# EAGLE design AC_load (EAGLE 6.5.0)
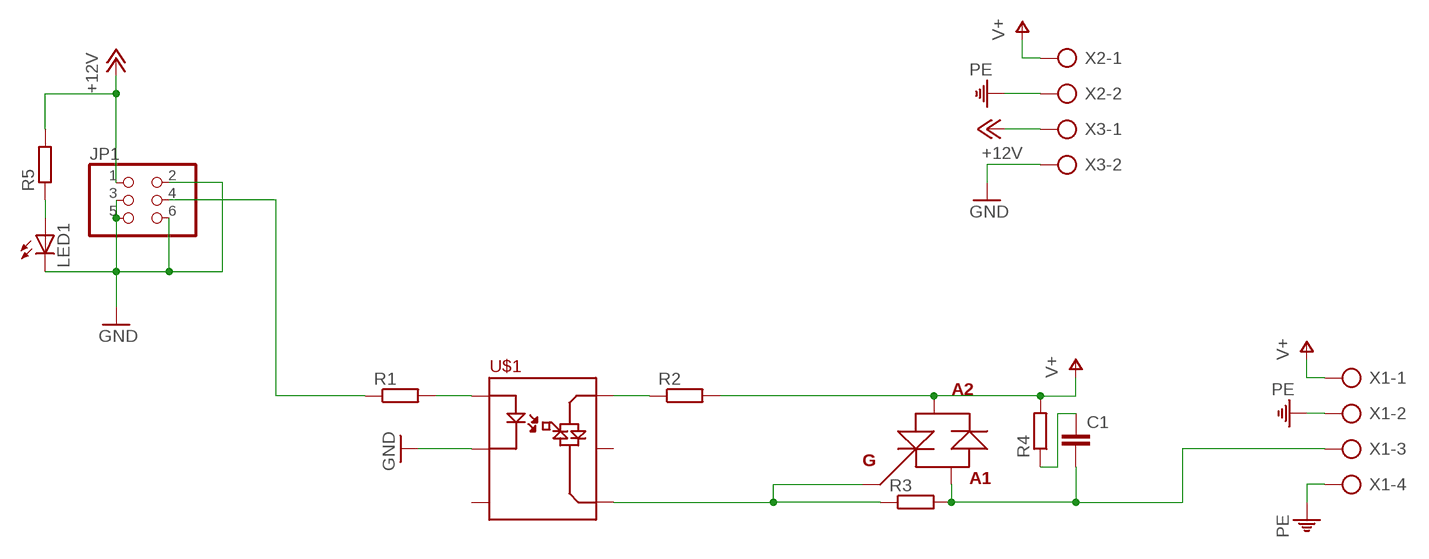
[diagram p0: schematic, sheet 1]

## Parts
C1  C-EU102-064X133  [C102-064X133]
JP1  PINHD-2X3  [2X03]
LED1  LEDSML1206  [SML1206]
R1  R-EU_M1206  [M1206]
R2  R-EU_M1206  [M1206]
R3  R-EU_M1206  [M1206]
R4  R-EU_M1206  [M1206]
R5  R-EU_M1206  [M1206]
U$1  MOC3043  [DIL06]
U$2  BTB16  [TO220NORM]
X1  AK500/4  [AK500/4]
X2  AK500/2  [AK500/2]
X3  AK500/2  [AK500/2]

## Nets
+12V: JP1.1 R5.2 X3.1
GND: JP1.2 JP1.3 JP1.5 JP1.6 LED1.C U$1.2(LED_OUT) X3.2
N$1: R1.2 U$1.1(LED_IN)
N$2: C1.2 R3.2 U$2.MT1(A1) X1.3
N$3: JP1.4 R1.1
N$4: R3.1 U$1.4(SIM2) U$2.GATE(G)
N$6: R2.1 U$1.6(SIM1)
N$7: C1.1 R4.1
N$14: LED1.A R5.1
PE: X1.2 X1.4 X2.2
V+: R2.2 R4.2 U$2.MT2(A2) X1.1 X2.1
Unconnected: U$1.3(N/C) U$1.5(N/C2)

## Library data of the parts
C1 = rcl:C-EU: CAPACITOR, European symbol
JP1 = pinhead:PINHD-2X3: PIN HEADER
LED1 = led:LED: LED OSRAM: - CHIPLED LG R971, LG N971, LY N971, LG Q971, LY Q971, LO R971, LY R971 LH N974, LH R974 LS Q976, LO Q976, LY Q976 LO Q996 - Hyper CHIPLED LW Q18S LB Q993, LB Q99A, LB R99A - SideLED LS A670, LO A670, LY A670, LG A670, LP A670 LB A673, LV A673, LT A673, LW A673 LH A674 LY A675 LS A676, LA A676, LO A676, LY A676, LW A676 LS A679, LY A679, LG A679 - Hyper Micro SIDELED® LS Y876, LA Y876, LO Y876, LY Y876 LT Y87S - SmartLED LW L88C, LW L88S LB L89C, LB L89S, LG L890 LS L89K, LO L89K, LY L89K LS L896, LA L896, LO L896, LY L896 - TOPLED LS T670, LO T670, LY T670, LG T670, LP T670 LSG T670, LSP T670, LSY T670, LOP T670, LYG T670 LG T671, LOG T671, LSG T671 LB T673, LV T673, LT T673, LW T673 LH T674 LS T676, LA T676, LO T676, LY T676, LB T676, LH T676, LSB T676, LW T676 LB T67C, LV T67C, LT T67C, LS T67K, LO T67K, LY T67K, LW E67C LS E67B, LA E67B, LO E67B, LY E67B, LB E67C, LV E67C, LT E67C LW T67C LS T679, LY T679, LG T679 LS T770, LO T770, LY T770, LG T770, LP T770 LB T773, LV T773, LT T773, LW T773 LH T774 LS E675, LA E675, LY E675, LS T675 LS T776, LA T776, LO T776, LY T776, LB T776 LHGB T686 LT T68C, LB T68C - Hyper Mini TOPLED® LB M676 - Mini TOPLED Santana® LG M470 LS M47K, LO M47K, LY M47K Source: http://www.osram.convergy.de LUXEON: - LUMILED® LXK2-PW12-R00, LXK2-PW12-S00, LXK2-PW14-U00, LXK2-PW14-V00 LXK2-PM12-R00, LXK2-PM12-S00, LXK2-PM14-U00 LXK2-PE12-Q00, LXK2-PE12-R00, LXK2-PE12-S00, LXK2-PE14-T00, LXK2-PE14-U00 LXK2-PB12-K00, LXK2-PB12-L00, LXK2-PB12-M00, LXK2-PB14-N00, LXK2-PB14-P00, LXK2-PB14-Q00 LXK2-PR12-L00, LXK2-PR12-M00, LXK2-PR14-Q00, LXK2-PR14-R00 LXK2-PD12-Q00, LXK2-PD12-R00, LXK2-PD12-S00 LXK2-PH12-R00, LXK2-PH12-S00 LXK2-PL12-P00, LXK2-PL12-Q00, LXK2-PL12-R00 Source: www.luxeon.com KINGBRIGHT: KA-3528ASYC Source: www.kingbright.com
R1-R5 = rcl:R-EU_: RESISTOR, European symbol
U$1 = OpticalSwitch:MOC3043
U$2 = Semistors:BTB16: Silicon Bidirectional Thyristors. Blocking Voltage to 800 V. On-State Current Rating of 16 A RMS at 25°C. http://www.onsemi.ru.com/pub_link/Collateral/BTB16-600CW3-D.PDF
X1 = con-ptr500:AK500/4: CONNECTOR; OC_FARNELL: unknown; OC_NEWARK: unknown
X2 X3 = con-ptr500:AK500/2: CONNECTOR; OC_FARNELL: unknown; OC_NEWARK: unknown

## Board
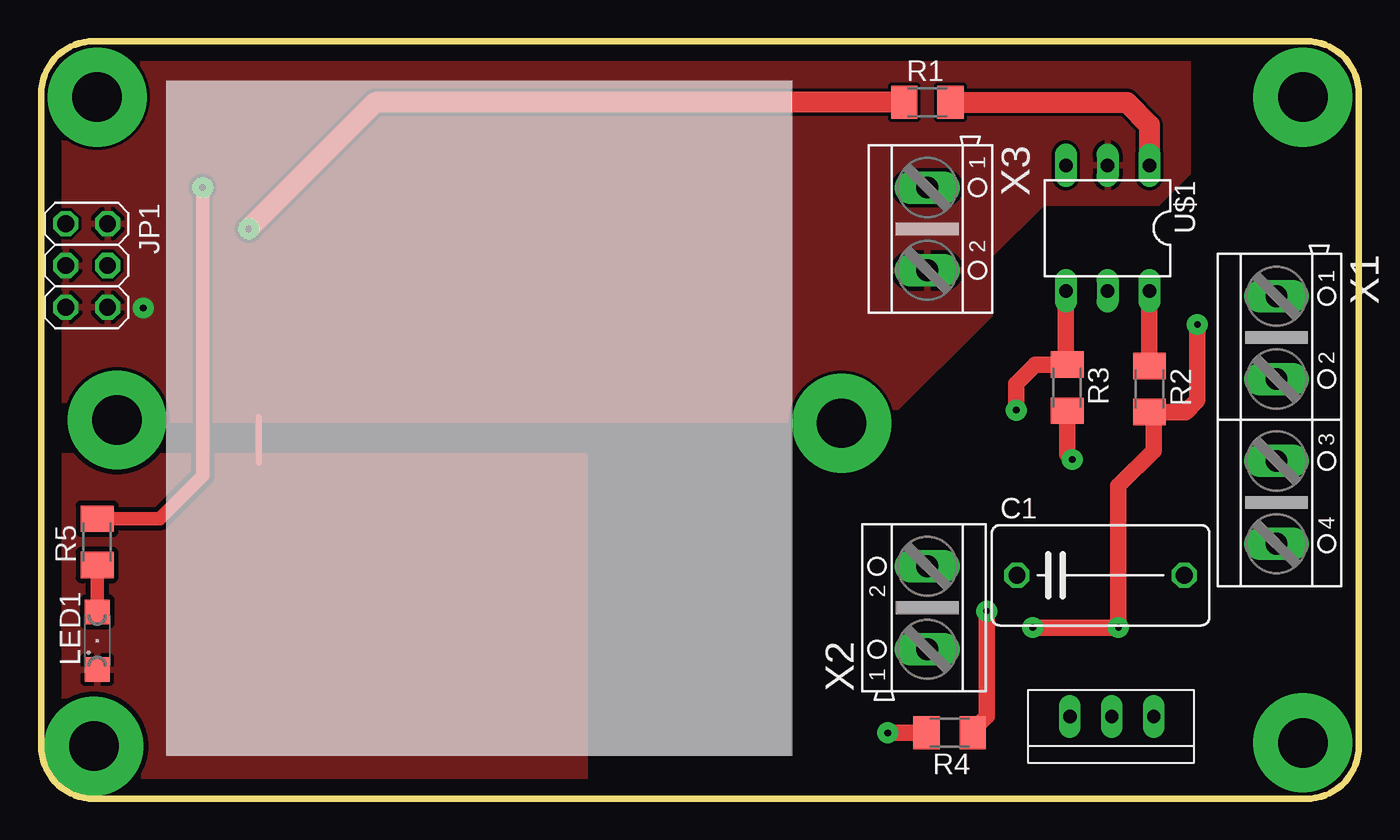
[diagram p1: board, top side]
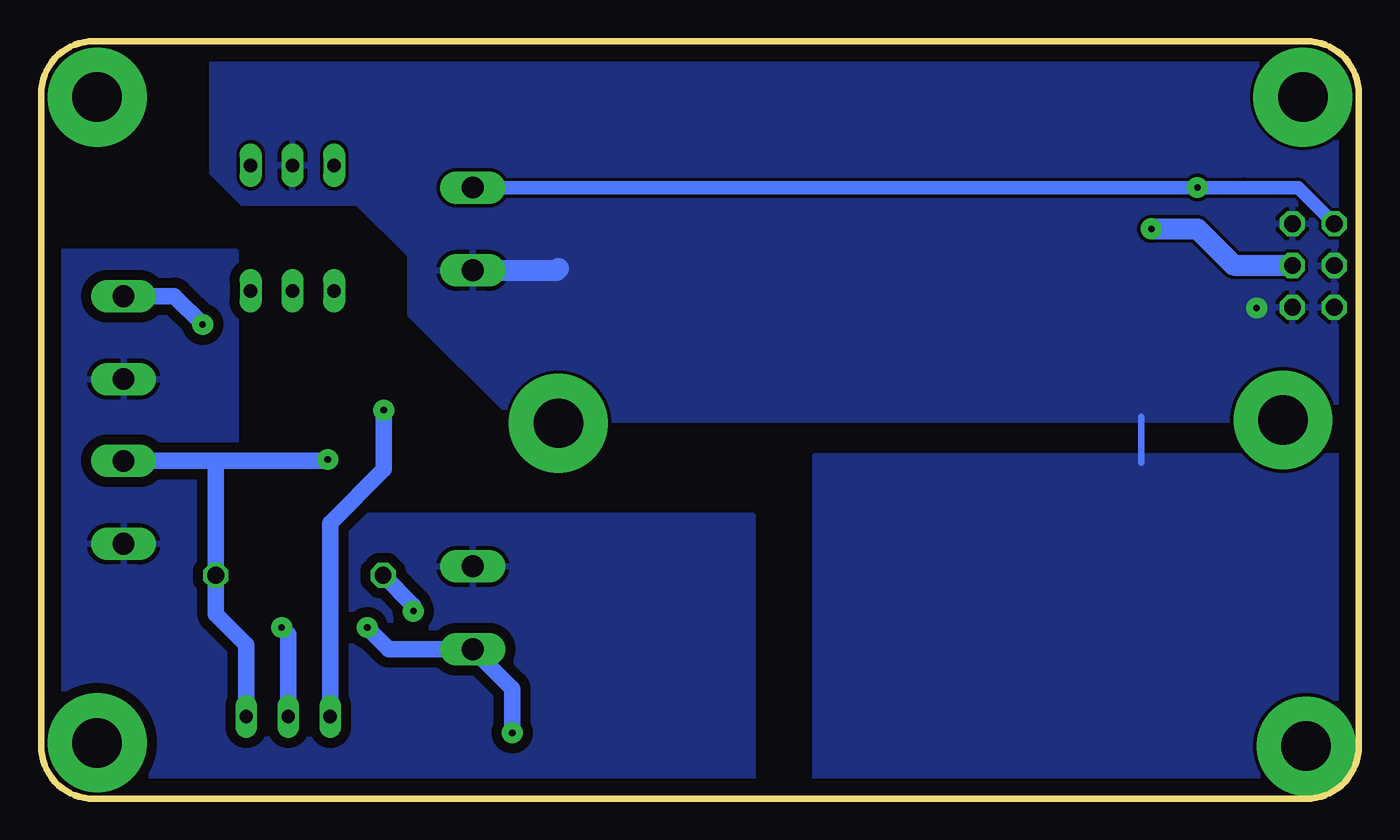
[diagram p2: board, bottom side, seen from below]

Size 80 x 46 mm. Coordinates in mm from the lower left corner, seen from the top.
Outline: 3.2,0 76.8,0 arc90 80,3.2 80,42.8 arc90 76.8,46 3.2,46 arc90 0,42.8 0,3.2 arc90 3.2,0
Copper layers (1*16): Top 0.035mm / dielectric 1.5mm / Bottom 0.035mm
Design rules "default": minimum track width 10mil, minimum drill 24mil, track to track 8mil, track to pad 8mil, pad to pad 8mil, via to via 8mil, smd to smd 8mil, copper to edge 40mil, drill to drill 8mil, minimum pad ring 10mil, minimum via ring 8mil, stop-mask expansion 4mil, vias tented up to drill 0mil, thermal gap 10mil

### Footprints (pad centres in the part's own frame; a part is rotated, then mirrored left to right if it is on the bottom)
C102-064X133 = drill 1.016 octagon: 1 -5.08,0; 2 5.08,0
2X03 = drill 1.016 octagon: 1 -2.54,-1.27; 2 -2.54,1.27; 3 0,-1.27; 4 0,1.27; 5 2.54,-1.27; 6 2.54,1.27
SML1206 = smd 1.5 x 1.5: A 1.75,0; C -1.75,0
M1206 = smd 1.6 x 2: 1 -1.4,0; 2 1.4,0
DIL06 = drill 0.813 long: 1 -2.54,-3.81; 2 0,-3.81; 3 2.54,-3.81; 4 2.54,3.81; 5 0,3.81; 6 -2.54,3.81
TO220NORM = drill 0.8 long: GATE 2.54,0; MT1 -2.54,0; MT2 0,0
AK500/4 = drill 1.321 long: 1 -7.518,0; 2 -2.489,0; 3 2.489,0; 4 7.518,0
AK500/2 = drill 1.321 long: 1 -2.515,0; 2 2.515,0

### Placement (x,y rotation side)
C1  64.32,13.57 0 top
JP1  2.76,32.38 270 top
LED1  3.4,9.6 90 top
R1  53.8,42.29 0 top
R2  67.29,24.88 270 top
R3  62.29,24.96 270 top
R4  55.16,4.01 180 top
R5  3.4,15.6 90 top
U$1  64.75,34.65 180 top
U$2  65,5 180 top
X1  75,23 270 top
X2  53.8,11.6 90 top
X3  53.8,34.6 270 top

### Tracks (layer width: path | path; a pad name or v marks a point on that pad's centre or on a via)
+12V  (via drill 0.4 pad 1.27)
  Top 0.813: R5.2 7.2,17 9.8,19.6 v9.8,37.12
  Bottom 0.813: X3.1 v9.8,37.12 7,37.12 3.69,37.12 JP1.1
GND  (via drill 0.4 pad 1.27)
  Top 0.406: 13.2,23.2 13.2,20.4
  Bottom 0.406: 13.2,23.2 13.2,20.4
  Bottom 1.27: X3.2 48.72,32.09 48.6,32.2
  other vias: 6.2,29.8
  pour Bottom: 0,23 51.2,23 57.6,29.4 57.6,33 60.8,36.2 67.8,36.2 69.6,38 69.6,46 0,46
  pour Top: 0,23 51.2,23 57.6,29.4 57.6,33 60.8,36.2 67.8,36.2 69.6,38 69.6,46 0,46
  pour Top (isolate 0.305): 33,0 0,0 0,20.8 33,20.8
  pour Bottom: 0,0 33,0 33,20.8 0,20.8
N$1
  Top 1.27: R1.2 65.91,42.29 67.29,40.91 U$1.1
N$2  (via drill 0.4 pad 1.27)
  Top 1.016: v62.6,20.6 62.29,20.91 R3.2
  Bottom 1.016: X1.3 69.4,20.51 | 69.4,20.51 62.69,20.51 v62.6,20.6 | 69.4,20.51 C1.2 69.4,11.2 67.54,9.34 U$2.MT1
N$3  (via drill 0.4 pad 1.27)
  Top 1.27: R1.1 20.29,42.29 v12.6,34.6
  Bottom 1.27: v12.6,34.6 9.8,34.6 7.6,32.4 4.05,32.4 JP1.4
N$4  (via drill 0.4 pad 1.27)
  Top 1.016: U$1.4 62.21,26.44 R3.1 60.36,26.36 59.2,25.2 v59.2,23.6
  Bottom 1.016: U$2.GATE 62.46,16.74 59.2,20 v59.2,23.6
N$5  (via drill 3 pad 6)
  other vias: 3.2,3.2
N$6
  Top 1.016: U$1.6 R2.1
N$7  (via drill 0.4 pad 1.27)
  Top 1.016: R4.1 56.56,4.16 57.4,5 v57.4,11.4
  Bottom 1.016: v57.4,11.4 57.4,11.73 C1.1
N$8  (via drill 3 pad 6)
  other vias: 76.6,3.4
N$9  (via drill 3 pad 6)
  other vias: 3.4,42.6
N$10  (via drill 3 pad 6)
  other vias: 76.6,42.6
N$11  (via drill 3 pad 6)
  other vias: 4.6,23
N$12  (via drill 3 pad 6)
  other vias: 48.6,22.8
N$14
  Top 0.813: LED1.A R5.1
PE
  pour Bottom (isolate 0.61): 80,33.2 68.2,33.2 68.2,17.2 36.8,17.2 36.8,0 80,0
V+  (via drill 0.4 pad 1.27)
  Top 1.016: v70.2,28.8 70.2,24.2 69.48,23.48 R2.2 67.54,23.23 67.54,21.14 65.4,19 65.4,11.6 v65.4,10.4 v60.2,10.4 | R4.2 v51.41,4.01 v51.4,4
  Bottom 1.016: X1.1 71.92,30.52 v70.2,28.8 | v60.2,10.4 58.88,9.09 X2.1 51.4,6.68 v51.4,4 | U$2.MT2 65,10 v65.4,10.4